# Altium schematic sheet CON_JTAG_UART.SchDoc: JTAG, UART connectors
size 420 x 297 mm; DocumentNumber: 20; SheetNumber: 20; SheetTotal: 37; ModifiedBy: -; CheckedDate: -; Title2: Fast Stabilizer; DivGrp: WUT ISE; Designer: G.Kasprowicz
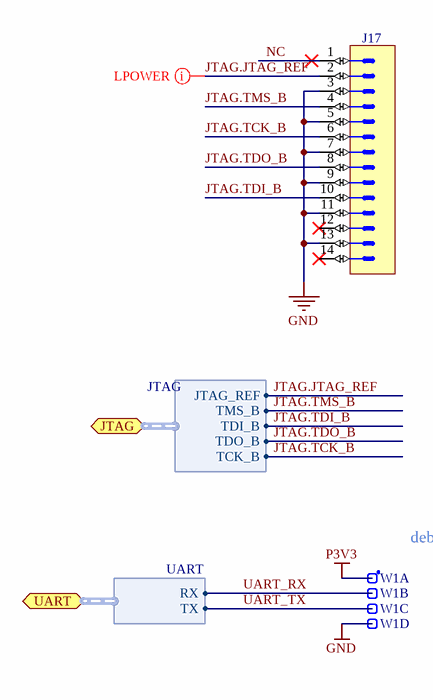
[diagram p0: CON_JTAG_UART.SchDoc]

## Parts
J17  Milli-Grid™  [MOLEX_87832-1420]  (value not drawn)
W1  Header 4  [SAMTEC_HTSW-104-23-L-S]  (value not drawn)  (parts A,B,C,D of 4)

## Ports
JTAG (bidir, harness JTAG), UART (bidir, harness UART)

## Harnesses
JTAG: JTAG_REF, TDO_B, TMS_B, TDI_B, TCK_B
UART: RX, TX

## Nets
GND: J17.3 J17.5 J17.7 J17.9 J17.11 J17.13 W1.4
P3V3: W1.1
JTAG.JTAG_REF: J17.2 ; port JTAG.JTAG_REF
JTAG.TCK_B: J17.6 ; port JTAG.TCK_B
JTAG.TDI_B: J17.10 ; port JTAG.TDI_B
JTAG.TDO_B: J17.8 ; port JTAG.TDO_B
JTAG.TMS_B: J17.4 ; port JTAG.TMS_B
NC: J17.1
UART_RX: W1.2 ; port UART.RX
UART_TX: W1.3 ; port UART.TX

Not connected (* = marked no-connect by the designer): J17 12* 14*

## Layout directives
net class Lpower: JTAG.JTAG_REF

## Notes on the sheet
- (near W1) debug UART
- Project/Equipment
- Document
- Designer
- Drawn by
- Check.by
- Copyright WUT ISE 2020.
  This documentation describes Open Hardware and is licensed under the CERN OHL v.1.2. You may redistribute and modify this documentation under the terms of the CERN OHL v.1.2. (http://ohwr.org/CERNOHL). This documentation is distributed WITHOUT ANY EXPRESS OR IMPLIED WARRANTY, INCLUDING OF MERCHANTABILITY, SATISFACTORY QUALITY AND FITNESS FOR A PARTICULAR PURPOSE. Please see the CERN OHL v.1.2 for applicable conditions.
- Contact
- File
- Last Mod.
- Print Date
- Sheet
- Size
- A3
- of
- Rev

## Library data of the parts
J17 = MOLEX_87832-1420: Connector 14 Male; Part Description: 2.00mm (.079") Pitch Milli-Grid™ Header, Surface Mount, Vertical, Shrouded, 14 Circuits,with Locking Windows and Centre Polarization Slot, PCB Locator; Manufacturer: MOLEX; PressFit: No; Part Number: MOLEX_87832-1420; Component Kind: Standard; Component Type: Standard; Pin Count: 14; Family: Milli-Grid™; Mounted: Yes; Socket: No; SMD: Yes; Sense: No; Status: None; Manufacturer Part Number: 87832-1420; ComponentHeight: 7.6mm; HelpURL: \\cern.ch\dfs\Applications\Altium\Datasheets\MOLEX_87832-1420.pdf; Author: CERN DEM JLC; CreateDate: 09-Sep-08; LatestRevisionDate: 09-Sep-08
W1 = SAMTEC_HTSW-104-23-L-S: 4 Mini Wire-Wrap Contact Strip Header; Part Description: 4 Contacts, Pitch 2.54mm, Single Row  Through Mount Straight Header (Post Lead 5.84mm, Tail Lead 2.92mm, Insulator 2.54mm); Manufacturer: SAMTEC; PressFit: No; Status Comment: High Temperature; Part Number: SAMTEC_HTSW-104-23-L-S; Component Kind: Standard; Component Type: Standard; Pin Count: 4; Family: Header 4; Mounted: Yes; Socket: No; Sense: No; SMD: No; Status: Preferred; Manufacturer Part Number: HTSW-104-23-L-S; ComponentHeight: 8.38mm; HelpURL: \\cern.ch\dfs\Applications\Altium\Datasheets\SAMTEC_HTSW-104-23-L-S.pdf; Author: CERN DEM JLC; CreateDate: 22/02/2018; LatestRevisionDate: 22/02/2018